# Altium schematic sheet Sch_front_old.SchDoc
size A
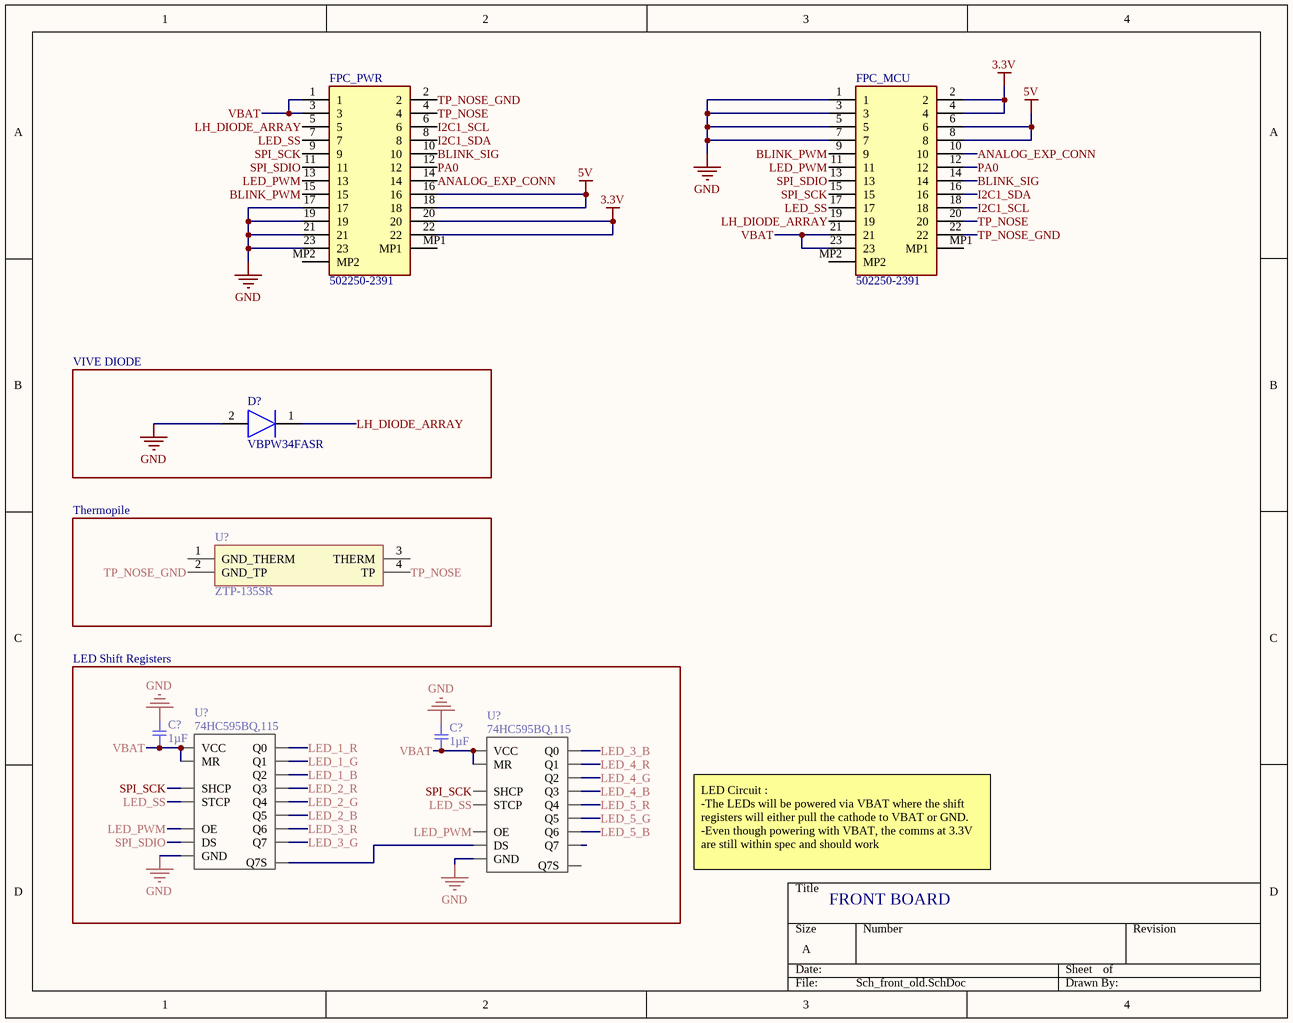
[diagram p0: Sch_front_old.SchDoc]

## Parts
(Parts that share a designator on the sheet are numbered #1, #2 ... from top to bottom, then left to right.)
C?#1  1µF  [SMD-0402C]
C?#2  1µF  [SMD-0402C]
D?  VBPW34FASR  [VBPW34FASR]
FPC_MCU  502250-2391  [5022502391]
FPC_PWR  502250-2391  [5022502391]
U?#1  ZTP-135SR  [ZTP-135SR]
U?#2  74HC595BQ,115  [QFN50P250X350X100-17N]
U?#3  74HC595BQ,115  [QFN50P250X350X100-17N]

## Blocks framed on the sheet
VIVE DIODE: D?
Thermopile: U?#1
LED Shift Registers: C?#1 C?#2 U?#2 U?#3

## Nets
3.3V: FPC_MCU.2 FPC_MCU.4 FPC_PWR.20 FPC_PWR.22
5V: FPC_MCU.6 FPC_MCU.8 FPC_PWR.16 FPC_PWR.18
GND: C?#1.2 C?#2.2 D?.2(K) FPC_MCU.1 FPC_MCU.3 FPC_MCU.5 FPC_MCU.7 FPC_PWR.17 FPC_PWR.19 FPC_PWR.21 FPC_PWR.23 U?#2.8(GND) U?#3.8(GND)
ANALOG_EXP_CONN: FPC_MCU.10 FPC_PWR.14
BLINK_PWM: FPC_MCU.9 FPC_PWR.15
BLINK_SIG: FPC_MCU.14 FPC_PWR.10
I2C1_SCL: FPC_MCU.18 FPC_PWR.6
I2C1_SDA: FPC_MCU.16 FPC_PWR.8
LED_1_B: U?#2.2(Q2)
LED_1_G: U?#2.1(Q1)
LED_1_R: U?#2.15(Q0)
LED_2_B: U?#2.5(Q5)
LED_2_G: U?#2.4(Q4)
LED_2_R: U?#2.3(Q3)
LED_3_B: U?#3.15(Q0)
LED_3_G: U?#2.7(Q7)
LED_3_R: U?#2.6(Q6)
LED_4_B: U?#3.3(Q3)
LED_4_G: U?#3.2(Q2)
LED_4_R: U?#3.1(Q1)
LED_5_B: U?#3.6(Q6)
LED_5_G: U?#3.5(Q5)
LED_5_R: U?#3.4(Q4)
LED_PWM: FPC_MCU.11 FPC_PWR.13 U?#2.13(OE) U?#3.13(OE)
LED_SS: FPC_MCU.17 FPC_PWR.7 U?#2.12(STCP) U?#3.12(STCP)
LH_DIODE_ARRAY: D?.1(A) FPC_MCU.19 FPC_PWR.5
PA0: FPC_MCU.12 FPC_PWR.12
SPI_SCK: FPC_MCU.15 FPC_PWR.9 U?#2.11(SHCP) U?#3.11(SHCP)
SPI_SDIO: FPC_MCU.13 FPC_PWR.11 U?#2.14(DS)
TP_NOSE: FPC_MCU.20 FPC_PWR.4 U?#1.4(TP)
TP_NOSE_GND: FPC_MCU.22 FPC_PWR.2 U?#1.2(GND_TP)
VBAT: C?#1.1 C?#2.1 FPC_MCU.21 FPC_MCU.23 FPC_PWR.1 FPC_PWR.3 U?#2.10(MR) U?#2.16(VCC) U?#3.10(MR) U?#3.16(VCC)
NetU?#2_9: U?#2.9(Q7S) U?#3.14(DS)

Not connected (* = marked no-connect by the designer): FPC_MCU MP1 MP2; FPC_PWR MP1 MP2; U?#1 1(GND_THERM) 3(THERM); U?#3 7(Q7) 9(Q7S)

## Notes on the sheet
- LED Circuit :
  -The LEDs will be powered via VBAT where the shift registers will either pull the cathode to VBAT or GND.
  -Even though powering with VBAT, the comms at 3.3V are still within spec and should work
- FRONT BOARD

## Library data of the parts
C?#1 C?#2 = GCM155C71A105KE38D: CAP CER 1UF 10V X7S 0402; Manufacturer: Murata Electronics North America; Factory Stock: 0; Unit Price (USD): 0.12; Minimum Quantity: 1; Tolerance: ±10%; Datasheets: http://www.murata.com/~/media/webrenewal/support/library/catalog/products/capacitor/mlcc/c03e.ashx; Image: //media.digikey.com/Renders/Murata%20Renders/ZRB-SERIES-0402.jpg; Digi-Key Part Number: 490-13409-1-ND; Part Number: GCM155C71A105KE38D; Quantity Available: 7240; @ qty: 0; Packaging: Cut Tape (CT); Series: GCM; Part Status: Active; Value: 1µF; Voltage: 10V; Temperature Coefficient: X7S; Operating Temperature: -55°C ~ 125°C; Features: -; Ratings: AEC-Q200; Applications: Automotive; Mounting Type: Surface Mount, MLCC; Package / Case: 0402 (1005 Metric); Size / Dimension: 0.039" L x 0.020" W (1.00mm x 0.50mm); Height - Seated (Max): -; Thickness (Max): 0.022" (0.55mm); Lead Spacing: -; Lead Style: -
D? = VBPW34FASR: Diode; Manufacturer_Name: Vishay; Datasheet Link: https://www.vishay.com/docs/81127/vbpw34fa.pdf; Height: 1.3mm; Manufacturer_Part_Number: VBPW34FASR; Mouser Part Number: 782-VBPW34FASR; Mouser Price/Stock: https://www.mouser.com/Search/Refine.aspx?Keyword=782-VBPW34FASR; RS Part Number: 7689401; RS Price/Stock: https://uk.rs-online.com/web/p/products/7689401
FPC_MCU FPC_PWR = 502250-2391: Connector; Manufacturer_Name: Molex; Datasheet Link: https://www.molex.com/pdm_docs/sd/5022501791_sd.pdf; Height: 1.85mm; Manufacturer_Part_Number: 502250-2391; Mouser Part Number: 538-502250-2391; Mouser Price/Stock: https://www.mouser.com/Search/Refine.aspx?Keyword=538-502250-2391; System: Connector
U?#1 = ZTP-135SR: Undefined or Miscellaneous; Manufacturer_Name: Amphenol Advanced Sensors; Allied_Number: 70282698; Datasheet Link: https://www.amphenol-sensors.com/en/component/edocman/370-thermopile-ir-sensor-applications/download?Itemid=7967; Manufacturer_Part_Number: ZTP-135SR; Mouser Part Number: 527-ZTP-135SR; Mouser Price/Stock: https://www.mouser.com/Search/Refine.aspx?Keyword=527-ZTP-135SR; Allied Price/Stock: https://www.alliedelec.com/amphenol-advanced-sensors-ztp-135sr/70282698/
U?#2 U?#3 = 74HC595: MF: STMicroelectronics; MP: 74HC165; Price: None; Package: VFQFN-16 STMicroelectronics; Availability: Unavailable; SnapEDA_Link: https://www.snapeda.com/parts/74HC165/STMicroelectronics/view-part/?ref=snap; Value: *